# Altium schematic sheet OpenPack_BATMOD_V1p0_MAIN.SchDoc
size A4; SheetNumber: 2; SheetTotal: 10; Title_: Main Page
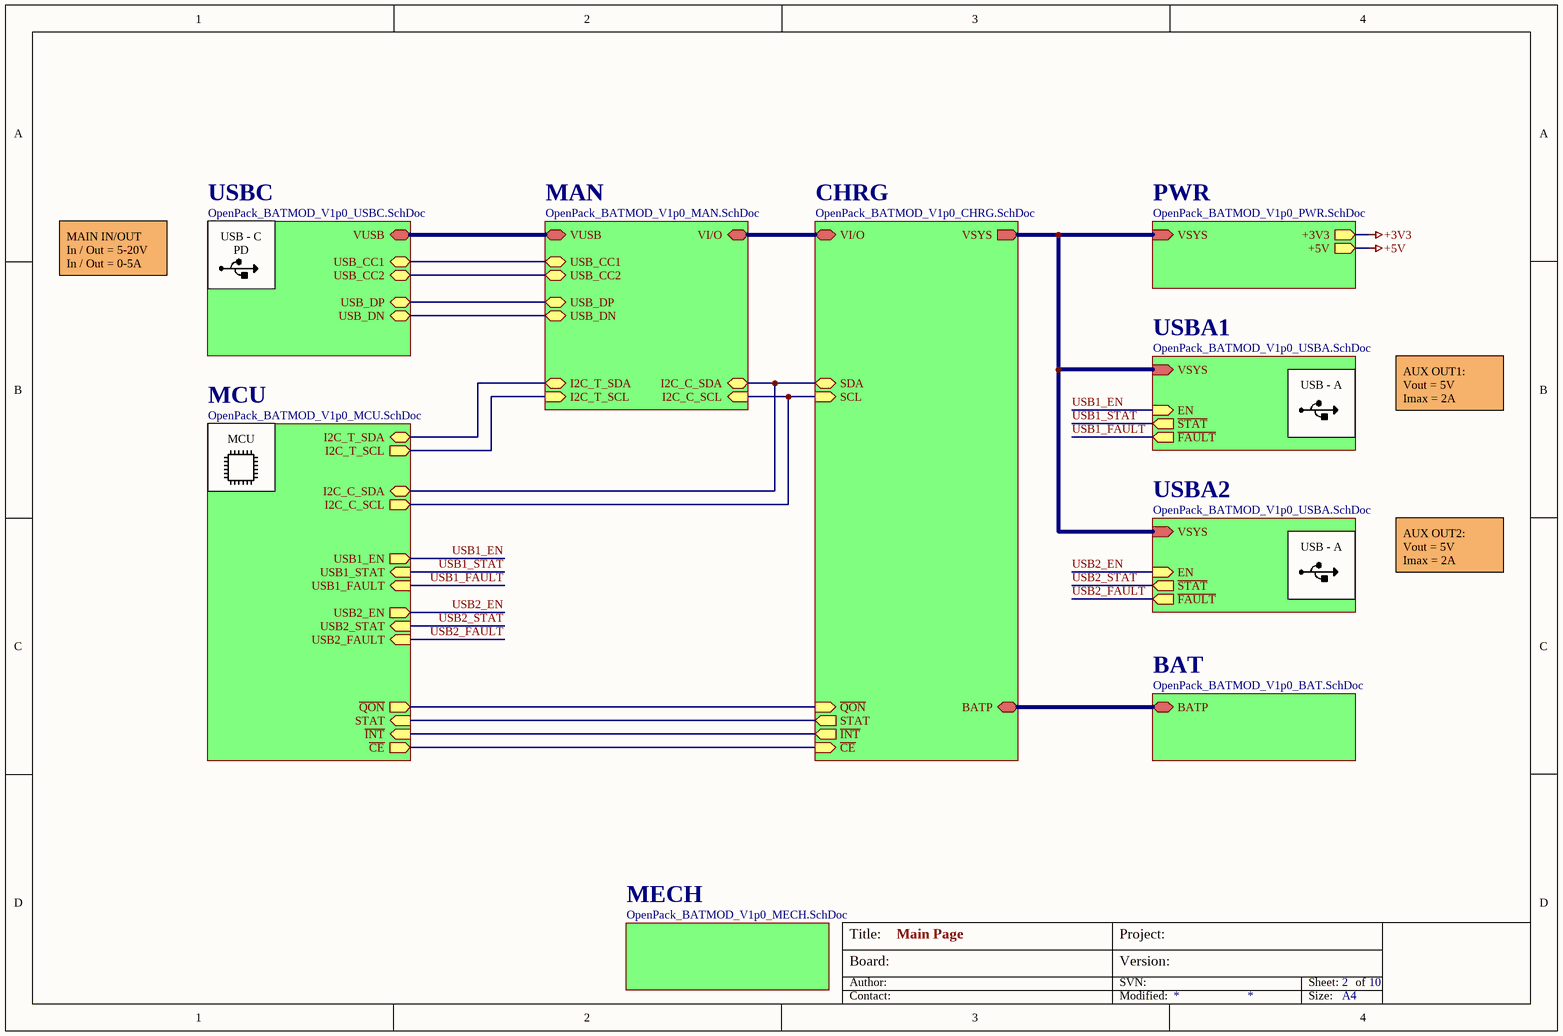
[diagram p0: OpenPack_BATMOD_V1p0_MAIN.SchDoc]

## Sub-sheets
BAT = OpenPack_BATMOD_V1p0_BAT.SchDoc: BATP (bidir)
CHRG = OpenPack_BATMOD_V1p0_CHRG.SchDoc: VI/O (bidir), VSYS (out), ~{CE} (in), ~{INT} (out), STAT (out), ~{QON} (in), SDA (bidir), SCL (in), BATP (bidir)
MAN = OpenPack_BATMOD_V1p0_MAN.SchDoc: VI/O (bidir), I2C_T_SDA (bidir), I2C_T_SCL (in), VUSB (bidir), USB_CC1 (bidir), USB_CC2 (bidir), USB_DP (bidir), USB_DN (bidir), I2C_C_SDA (bidir), I2C_C_SCL (in)
MCU = OpenPack_BATMOD_V1p0_MCU.SchDoc: ~{CE} (out), ~{QON} (out), STAT (in), ~{INT} (in), I2C_T_SDA (bidir), I2C_T_SCL (out), I2C_C_SDA (bidir), I2C_C_SCL (out), USB1_EN (out), USB1_STAT (in), USB1_FAULT (in), USB2_EN (out), USB2_STAT (in), USB2_FAULT (in)
MECH = OpenPack_BATMOD_V1p0_MECH.SchDoc: no entries
PWR = OpenPack_BATMOD_V1p0_PWR.SchDoc: VSYS (in), +3V3 (out), +5V (out)
USBA1 = OpenPack_BATMOD_V1p0_USBA.SchDoc: VSYS (in), EN (in), ~{STAT} (out), ~{FAULT} (out)
USBA2 = OpenPack_BATMOD_V1p0_USBA.SchDoc: VSYS (in), EN (in), ~{STAT} (out), ~{FAULT} (out)
USBC = OpenPack_BATMOD_V1p0_USBC.SchDoc: VUSB (bidir), USB_CC1 (bidir), USB_CC2 (bidir), USB_DP (bidir), USB_DN (bidir)

## Nets
+3V3: sheet PWR/+3V3
+5V: sheet PWR/+5V
USB1_EN: sheet USBA1/EN, sheet MCU/USB1_EN
USB1_FAULT: sheet USBA1/~{FAULT}, sheet MCU/USB1_FAULT
USB1_STAT: sheet USBA1/~{STAT}, sheet MCU/USB1_STAT
USB2_EN: sheet USBA2/EN, sheet MCU/USB2_EN
USB2_FAULT: sheet USBA2/~{FAULT}, sheet MCU/USB2_FAULT
USB2_STAT: sheet USBA2/~{STAT}, sheet MCU/USB2_STAT
(unnamed): sheet CHRG/VI/O, sheet MAN/VI/O
(unnamed): sheet CHRG/VSYS, sheet PWR/VSYS, sheet USBA1/VSYS, sheet USBA2/VSYS
(unnamed): sheet CHRG/~{CE}, sheet MCU/~{CE}
(unnamed): sheet CHRG/~{INT}, sheet MCU/~{INT}
(unnamed): sheet CHRG/STAT, sheet MCU/STAT
(unnamed): sheet CHRG/~{QON}, sheet MCU/~{QON}
(unnamed): sheet CHRG/SDA, sheet MAN/I2C_C_SDA, sheet MCU/I2C_C_SDA
(unnamed): sheet CHRG/SCL, sheet MAN/I2C_C_SCL, sheet MCU/I2C_C_SCL
(unnamed): sheet CHRG/BATP, sheet BAT/BATP
(unnamed): sheet MAN/I2C_T_SDA, sheet MCU/I2C_T_SDA
(unnamed): sheet MAN/I2C_T_SCL, sheet MCU/I2C_T_SCL
(unnamed): sheet MAN/VUSB, sheet USBC/VUSB
(unnamed): sheet MAN/USB_CC1, sheet USBC/USB_CC1
(unnamed): sheet MAN/USB_CC2, sheet USBC/USB_CC2
(unnamed): sheet MAN/USB_DP, sheet USBC/USB_DP
(unnamed): sheet MAN/USB_DN, sheet USBC/USB_DN

## Notes on the sheet
- USB - C
  PD
- MAIN IN/OUT
  In / Out = 5-20V
  In / Out = 0-5A
- USB - A
- AUX OUT1:
  Vout = 5V
  Imax = 2A
- MCU
- AUX OUT2:
  Vout = 5V
  Imax = 2A
- Board:
- Author:
- Title:
- Project:
- SVN:
- Version:
- Sheet:
- of
- Contact:
- Modified:
- Size:
- A4